# EAGLE design filter (EAGLE 7.5.0)
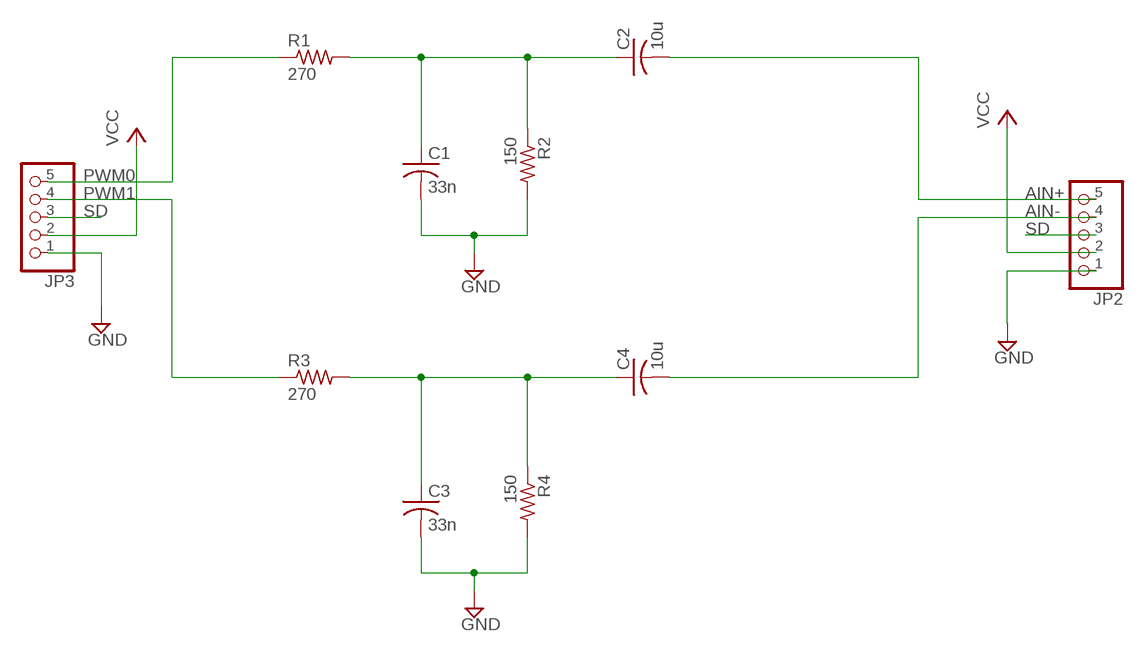
[diagram p0: schematic, sheet 1]

## Parts
C1  33n  C-USC0805  [C0805]
C2  10u  C-USC0805  [C0805]
C3  33n  C-USC0805  [C0805]
C4  10u  C-USC0805  [C0805]
JP2  PINHD-1X5  [1X05]
JP3  PINHD-1X5  [1X05]
R1  270  R-US_M0805  [M0805]
R2  150  R-US_M0805  [M0805]
R3  270  R-US_M0805  [M0805]
R4  150  R-US_M0805  [M0805]

## Nets
AIN+: C2.2 JP2.5
AIN-: C4.2 JP2.4
GND: C1.2 C3.2 JP2.1 JP3.1 R2.2 R4.2
N$2: C1.1 C2.1 R1.2 R2.1
N$7: C3.1 C4.1 R3.2 R4.1
PWM0: JP3.5 R1.1
PWM1: JP3.4 R3.1
SD: JP2.3 JP3.3
VCC: JP2.2 JP3.2

## Library data of the parts
C1-C4 = adafruit:C-US: CAPACITOR, American symbol
JP2 JP3 = pinhead:PINHD-1X5: PIN HEADER
R1-R4 = adafruit:R-US_: RESISTOR, American symbol

## Board
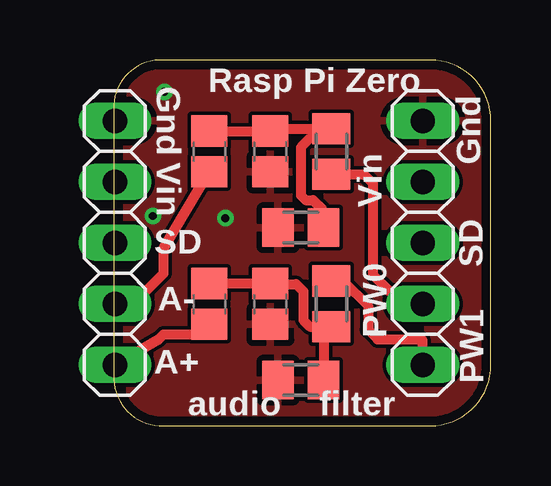
[diagram p1: board, top side]
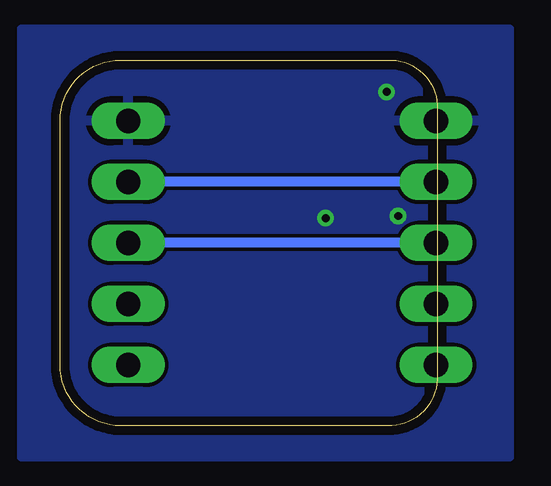
[diagram p2: board, bottom side, seen from below]

Size 15.72 x 15.24 mm. Coordinates in mm from the lower left corner, seen from the top.
Outline: 0,13.37 0,1.94 arc90 2.08,0 13.18,0 arc90 15.72,2.54 15.72,12.7 arc90 13.18,15.24 2.08,15.24 arc90 0,13.37
Copper layers (1*16): Top 0.0356mm / dielectric 1.5011mm / Bottom 0.0356mm
Design rules "LaenPCBOrder *": minimum track width 6mil, minimum drill 13mil, track to track 6mil, track to pad 6mil, pad to pad 6mil, via to via 6mil, smd to smd 6mil, copper to edge 15mil, drill to drill 6mil, minimum pad ring 7mil, minimum via ring 7mil, stop-mask expansion 4mil, vias tented up to drill 24mil, thermal gap 10mil

### Footprints (pad centres in the part's own frame; a part is rotated, then mirrored left to right if it is on the bottom)
C0805 = smd 1.3 x 1.5: 1 -0.85,0; 2 0.85,0
1X05 = drill 1.016 long: 1 -5.08,0; 2 -2.54,0; 3 0,0; 4 2.54,0; 5 5.08,0
M0805 = smd 1.3 x 1.6: 1 -0.95,0; 2 0.95,0

### Placement (x,y rotation side)
C1  6.53,5.08 270 top
C2  3.99,5.08 270 top
C3  6.53,11.43 270 top
C4  3.99,11.43 270 top
JP2  0.05,7.62 270 top
JP3  12.88,7.62 270 top
R1  9.06,5.08 270 top
R2  7.79,1.91 180 top
R3  9.06,11.43 90 top
R4  7.79,8.26 180 top

### Tracks (layer width: path | path; a pad name or v marks a point on that pad's centre or on a via)
AIN+
  Top 0.406: JP2.5 1.89,3.62 2.08,3.81 3.57,3.81 C2.2
AIN-
  Top 0.406: JP2.4 1.35,5.62 2.08,6.35 2.08,7.41 C4.2
GND  (via drill 0.33)
  other vias: 2.11,13.91 1.63,8.74 4.65,8.65
  pour Top: 13.51,0 2.08,0 arc-90 0.03,1.64 0.03,13.07 arc-90 2.08,15.24 13.51,15.24 arc-90 15.75,12.7 15.75,2.54 arc-90
  pour Bottom: -1.73,16.51 17.32,16.51 17.32,-1.27 -3,-1.27 -3,16.51
N$2
  Top 0.406: C2.1 C1.1 6.55,5.9 7.6,5.9 7.9,5.6 7.9,4.4 8.17,4.13 R1.2 8.74,3.81 R2.1
N$7
  Top 0.406: C4.1 C3.1 6.62,12.38 R3.2 8.58,12.38 7.8,11.6 7.8,9.6 8,9.4 8.3,9.4 8.7,9 8.7,8.3 R4.1
PWM0
  Top 0.406: R1.1 9.57,6.03 10.6,5 10.6,4 11,3.6 12.86,3.6 JP3.5
PWM1
  Top 0.406: R3.1 10.42,10.48 10.8,10.1 10.8,6.3 11.48,5.62 JP3.4
SD
  Bottom 0.406: JP2.3 JP3.3
VCC
  Bottom 0.406: JP2.2 JP3.2

### Text on the board
tPlace: Rasp Pi Zero | Gnd | Gnd | Vin | Vin | SD | SD | A- | PW0 | A+ | PW1 | audio filter